# Altium schematic sheet STM32_EDITED.SchDoc
size A4
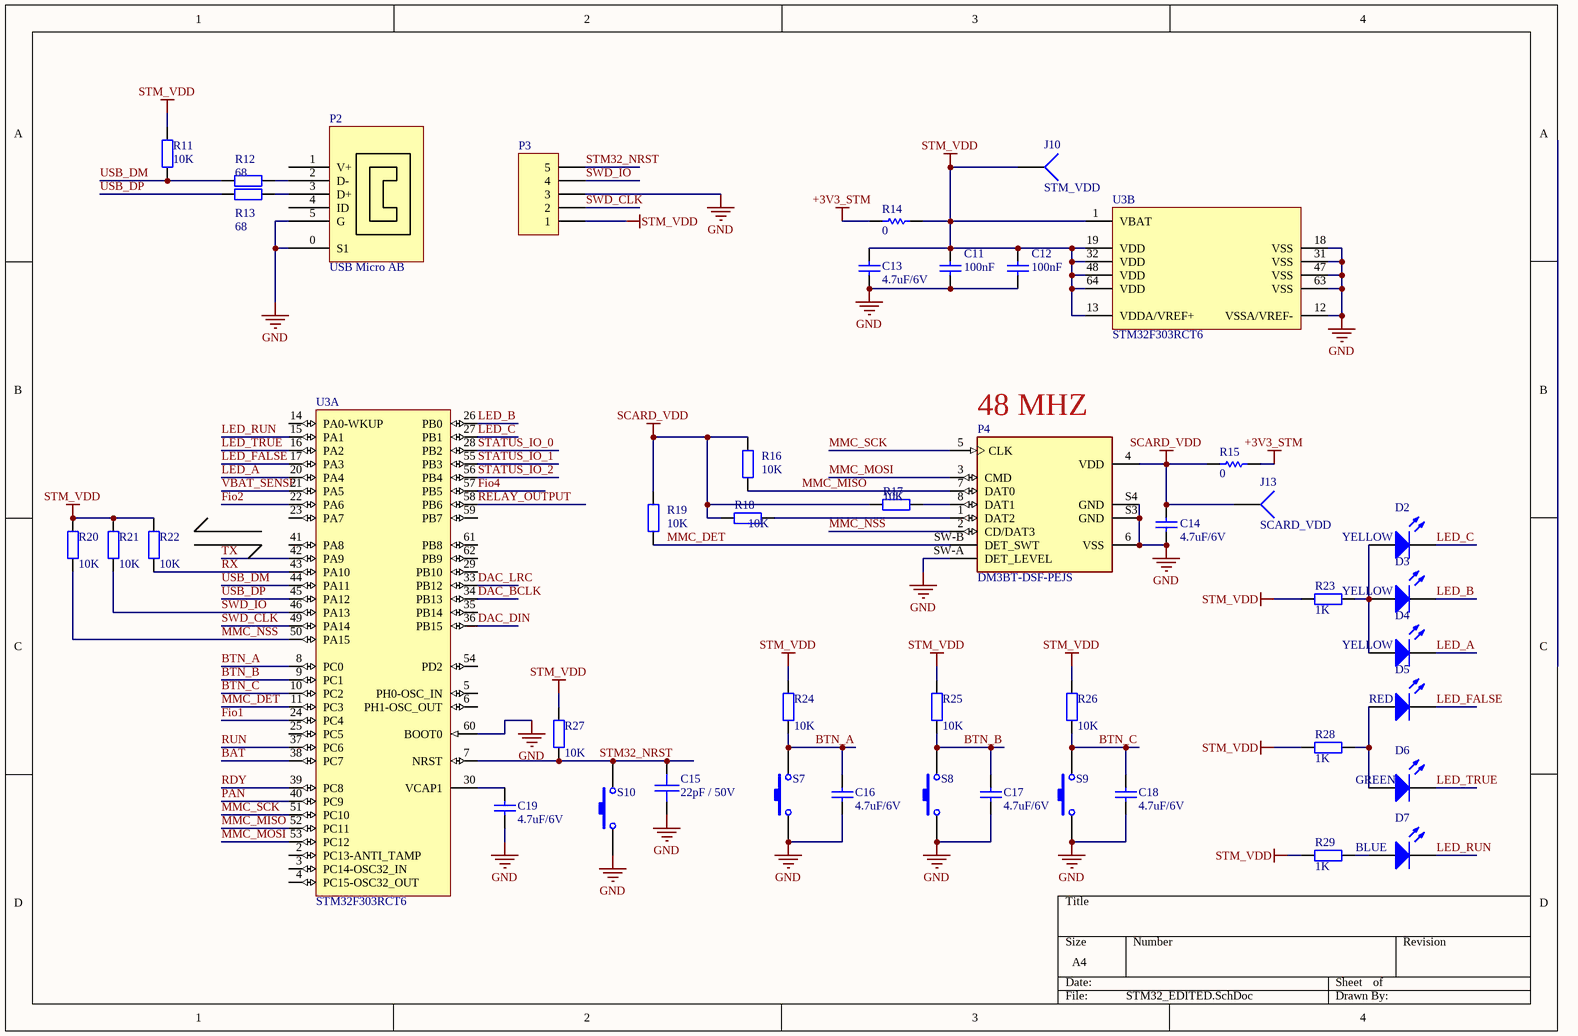
[diagram p0: STM32_EDITED.SchDoc]

## Parts
C11  100nF  [CR2012-0805]
C12  100nF  [CR2012-0805]
C13  4.7uF/6V  [CR2012-0805]
C14  4.7uF/6V  [CR2012-0805]
C15  22pF / 50V  [CR2012-0805]
C16  4.7uF/6V  [CR2012-0805]
C17  4.7uF/6V  [CR2012-0805]
C18  4.7uF/6V  [CR2012-0805]
C19  4.7uF/6V  [CR2012-0805]
D2  YELLOW  [LED1206]
D3  YELLOW  [LED1206]
D4  YELLOW  [LED1206]
D5  RED  [LED1206]
D6  GREEN  [LED1206]
D7  BLUE  [LED1206]
J10  STM_VDD  [PIN1]
J13  SCARD_VDD  [PIN1]
P2  USB Micro AB  [USB_MICRO_wi_LEG]
P3  SWD_STM32  [HDR1X5]  (value not drawn)
P4  DM3BT-DSF-PEJS  [HRS_DM3BT-DSF-PEJS]
R11  10K  [CR2012-0805]
R12  68  [CR2012-0805]
R13  68  [CR2012-0805]
R14  0  [JP1_SMD]
R15  0  [JP1_SMD]
R16  10K  [CR2012-0805]
R17  10K  [CR2012-0805]
R18  10K  [CR2012-0805]
R19  10K  [CR2012-0805]
R20  10K  [CR2012-0805]
R21  10K  [CR2012-0805]
R22  10K  [CR2012-0805]
R23  1K  [CR2012-0805]
R24  10K  [CR2012-0805]
R25  10K  [CR2012-0805]
R26  10K  [CR2012-0805]
R27  10K  [CR2012-0805]
R28  1K  [CR2012-0805]
R29  1K  [CR2012-0805]
S7  SW-PB  [pushbutton]  (value not drawn)
S8  SW-PB  [pushbutton]  (value not drawn)
S9  SW-PB  [pushbutton]  (value not drawn)
S10  SW-PB  [pushbutton]  (value not drawn)
U3  STM32F303RCT6  [STM-LQFP64_N]  (parts A,B of 2)

## Nets
+3V3_STM: R14.1 R15.1
GND: C11.1 C12.1 C13.1 C14.1 C15.2 C16.1 C17.1 C18.1 C19.1 P2.0(S1) P2.5(G) P3.3 P4.6(VSS) P4.S3(GND) P4.S4(GND) P4.SW-A(DET_LEVEL) S7.1 S8.1 S9.1 S10.1 U3.12(VSSA/VREF-) U3.18(VSS) U3.31(VSS) U3.47(VSS) U3.60(BOOT0) U3.63(VSS)
SCARD_VDD: C14.2 J13.1 P4.4(VDD) R15.2 R16.2 R17.1 R18.1 R19.2
STM_VDD: C11.2 C12.2 C13.2 J10.1 P3.1 R11.2 R14.2 R20.1 R21.1 R22.1 R23.2 R24.1 R25.1 R26.1 R27.2 R28.2 R29.2 U3.1(VBAT) U3.13(VDDA/VREF+) U3.19(VDD) U3.32(VDD) U3.48(VDD) U3.64(VDD)
BAT: U3.38(PC7)
BTN_A: C16.2 R24.2 S7.2 U3.8(PC0)
BTN_B: C17.2 R25.2 S8.2 U3.9(PC1)
BTN_C: C18.2 R26.2 S9.2 U3.10(PC2)
DAC_BCLK: U3.34(PB13)
DAC_DIN: U3.36(PB15)
DAC_LRC: U3.33(PB12)
Fio1: U3.24(PC4)
Fio2: U3.22(PA6)
Fio4: U3.57(PB5)
LED_A: D4.K U3.20(PA4)
LED_B: D3.K U3.26(PB0)
LED_C: D2.K U3.27(PB1)
LED_FALSE: D5.K U3.17(PA3)
LED_RUN: D7.K U3.15(PA1)
LED_TRUE: D6.K U3.16(PA2)
MMC_DET: P4.SW-B(DET_SWT) R19.1 U3.11(PC3)
MMC_MISO: P4.7(DAT0) R16.1 U3.52(PC11)
MMC_MOSI: P4.3(CMD) U3.53(PC12)
MMC_NSS: P4.2(CD/DAT3) R20.2 U3.50(PA15)
MMC_SCK: P4.5(CLK) U3.51(PC10)
PAN: U3.40(PC9)
RDY: U3.39(PC8)
RELAY_OUTPUT: U3.58(PB6)
RUN: U3.37(PC6)
RX: R22.2 U3.43(PA10)
STATUS_IO_0: U3.28(PB2)
STATUS_IO_1: U3.55(PB3)
STATUS_IO_2: U3.56(PB4)
STM32_NRST: C15.1 P3.5 R27.1 S10.2 U3.7(NRST)
SWD_CLK: P3.2 U3.49(PA14)
SWD_IO: P3.4 R21.2 U3.46(PA13)
TX: U3.42(PA9)
USB_DM: R11.1 R12.1 U3.44(PA11)
USB_DP: R13.1 U3.45(PA12)
VBAT_SENSE: U3.21(PA5)
NetC19_2: C19.2 U3.30(VCAP1)
NetD2_A: D2.A D3.A D4.A R23.1
NetD5_A: D5.A D6.A R28.1
NetD7_A: D7.A R29.1
NetP2_2: P2.2(D-) R12.2
NetP2_3: P2.3(D+) R13.2
NetP4_1: P4.1(DAT2) R18.2
NetP4_8: P4.8(DAT1) R17.2

Not connected (* = marked no-connect by the designer): P2 1(V+) 4(ID); U3 2(PC13-ANTI_TAMP) 3(PC14-OSC32_IN) 4(PC15-OSC32_OUT) 5(PH0-OSC_IN) 6(PH1-OSC_OUT) 14(PA0-WKUP) 23(PA7) 25(PC5) 29(PB10) 35(PB14) 41(PA8) 54(PD2) 59(PB7) 61(PB8) 62(PB9)

## Notes on the sheet
- (near P4) 48 MHZ

## Library data of the parts
C11 C12 C14 = Cap: Capacitor; Published: 8-Jun-2000; LatestRevisionDate: 17-Jul-2002; LatestRevisionNote: Re-released for DXP Platform.; PackageReference: RAD-0.3; Publisher: Altium Limited; PackageDescription: Radial Cap, Thru-Hole; 2 Leads; 0.3 in Pin Spacing
  C11 C12: Value: 100nF
  C14: Value: 4.7uF/6V
C13 C16-C19 = Cap Semi: Capacitor (Semiconductor SIM Model); Published: 8-Jun-2000; LatestRevisionDate: 29-May-2009; LatestRevisionNote: IPC-7351 Footprint Added.; PackageReference: C1206; Publisher: Altium Limited; PackageDescription: Chip Capacitor; Unit Price: 0.15; Value: 4.7uF/6V
C15 = SMT_C_0402: Surface mount capacitor 0402
D2-D7 = LED0: Typical INFRARED GaAs LED; Published: 8-Jun-2000; LatestRevisionDate: 08-Jul-2005; LatestRevisionNote: Mech Layer 1 removed.; PackageReference: LED-0; Publisher: Altium Limited; PackageDescription: LED; 2 Leads
J10 J13 = Socket: LatestRevisionDate: 17-Jul-2002; LatestRevisionNote: Re-released for DXP Platform.; Publisher: Altium Limited
P2 = USB Micro AB: USB Micro AB connector
P3 = Header 5: Header, 5-Pin; LatestRevisionDate: 17-Jul-2002; LatestRevisionNote: Re-released for DXP Platform.; Publisher: Altium Limited
P4 = DM3BT-DSF-PEJS: 10 _8 + 2_ microSDâ„¢ Surface Mount, Right Angle Gold; MP: 502570-0893; MF: Molex; Price: None; Package: None; Value: *; Availability: Unavailable; SnapEDA_Link: https://www.snapeda.com/parts/502570-0893/Molex/view-part/225170/?ref=snap
R11-R13 R16-R29 = Res2: Resistor; Published: 8-Jun-2000; LatestRevisionDate: 17-Jul-2002; LatestRevisionNote: Re-released for DXP Platform.; PackageReference: AXIAL-0.4; Publisher: Altium Limited; PackageDescription: Axial Device, Thru-Hole; 2 Leads; 0.4 in Pin Spacing
  R11 R16-R22 R24-R27: Value: 10K
  R12 R13: Value: 68
  R23 R28 R29: Value: 1K
R14 R15 = Res Semi: Semiconductor Resistor; Published: 8-Jun-2000; LatestRevisionDate: 17-Jul-2002; LatestRevisionNote: Re-released for DXP Platform.; PackageReference: AXIAL-0.5; Publisher: Altium Limited; Unit Price: 0.15; Value: 0
S7-S10 = SW-PB: Switch; Published: 24-Mar-1999; LatestRevisionDate: 17-Jul-2002; LatestRevisionNote: Re-released for DXP Platform.; PackageReference: SPST-2; Publisher: Altium Limited; PackageDescription: Switch; 2 Leads
U3 = STM32F401RCT6: ARM Cortex-M4 32-bit MCU+FPU, 105 DMIPS, 256 kB Flash, 64 kB Internal RAM, 48 I/Os, 64-pin LQFP, -40 to 85 degC, Tray; Manufacturer: STMicroelectronics; FLASH Size (Prog) (kB): 256; I/Os (High Current): 48; Internal RAM Size (kB): 64; Operating Frequency(F) (Processor speed) (MHz): 84; Supply Voltage(Vcc) max (V): 3.6; Supply Voltage(Vcc) min (V): 1.8; DatasheetVersion: Rev. 1; PackageVersion: Rev. 4, 06/2013; PackageReference: LQFP64; PackageDescription: 64-Pin Low Profile Quad Flat Package, 10 x 10 mm Body, 0.5 mm Pitch; Supplier 1: Digi-Key; Supplier Part Number 1: 497-14047-ND; Supplier 2: Newark; Supplier Part Number 2: 19X6221; Supplier 3: Mouser; Supplier Part Number 3: 511-STM32F401RCT6; Core: ARM Cortex-M4; Packing: Tray; Mounting Technology: Surface Mount; PartNumber: STM32F401RCT6; ComponentLink1Description: Manufacturer URL; ComponentLink1URL: http://www.st.com/web/en/home.html; ComponentLink2Description: Datasheet; ComponentLink2URL: http://www.st.com/st-web-ui/static/active/en/resource/technical/document/data_brief/DM00071938.pdf; ComponentLink3Description: Package Specification; ComponentLink3URL: http://www.st.com/st-web-ui/static/active/en/resource/technical/document/datasheet/DM00037051.pdf